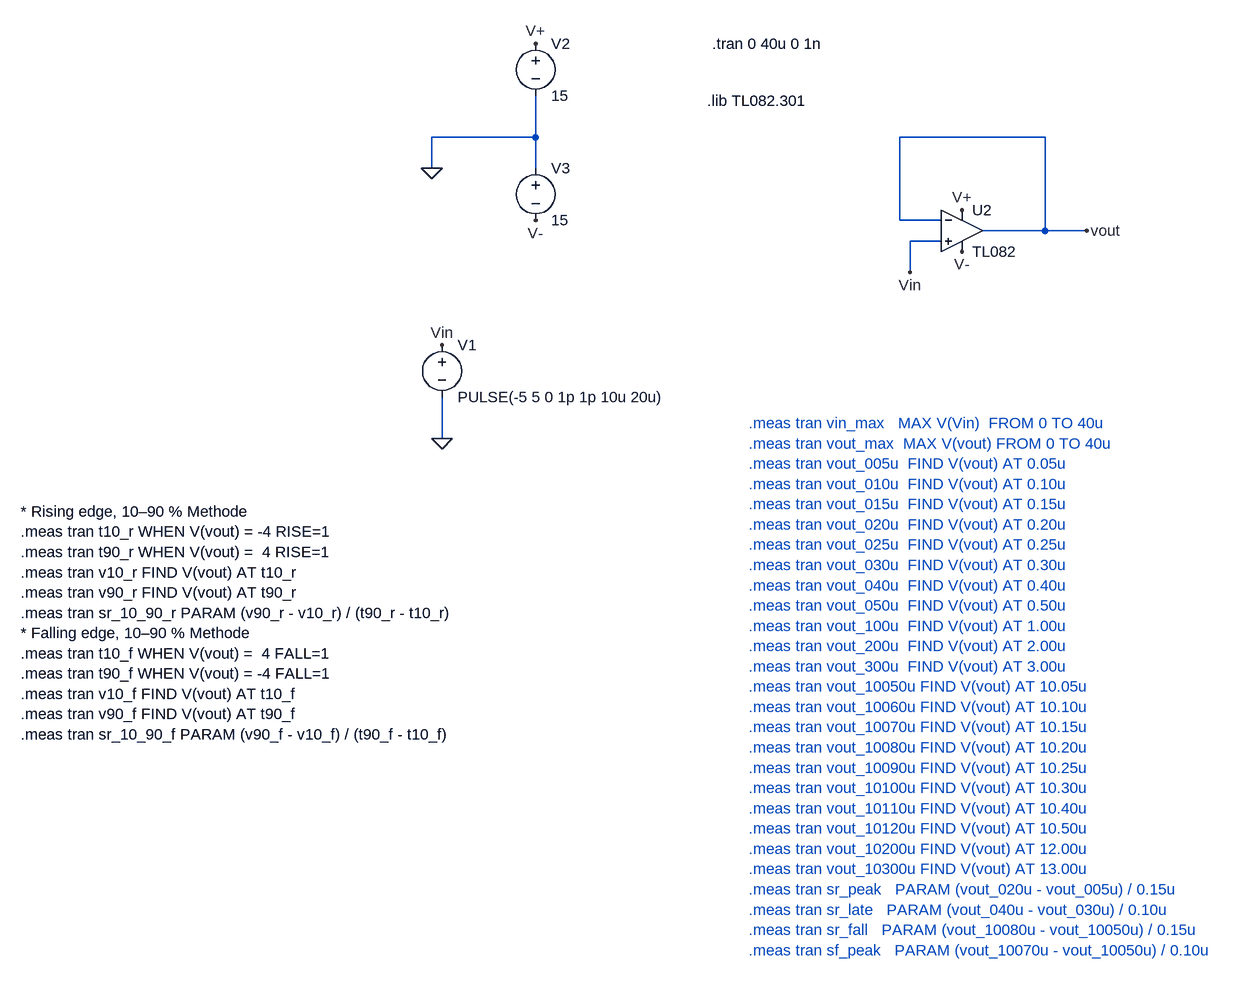
[diagram p0: schematic WORKS-non-inverting-buffer-test-slew-rate-tl802-op-amp.asc]
WORKS-non-inverting-buffer-test-slew-rate-tl802-op-amp.asc, the LTspice schematic file:
Version 4
SHEET 1 1576 900
WIRE -560 -128 -560 -192
WIRE -560 -128 -720 -128
WIRE 224 -128 0 -128
WIRE -720 -80 -720 -128
WIRE -560 -80 -560 -128
WIRE 0 0 0 -128
WIRE 64 0 0 0
WIRE 224 16 224 -128
WIRE 224 16 128 16
WIRE 288 16 224 16
WIRE 64 32 16 32
WIRE 16 80 16 32
WIRE -704 336 -704 272
FLAG 288 16 vout
FLAG 16 80 Vin
FLAG -704 336 0
FLAG -704 192 Vin
FLAG -720 -80 0
FLAG -560 0 V-
FLAG -560 -272 V+
FLAG 96 48 V-
FLAG 96 -16 V+
SYMBOL voltage -704 176 R0
SYMATTR InstName V1
SYMATTR Value PULSE(-5 5 0 1p 1p 10u 20u)
SYMBOL OpAmps/opamp2 96 -48 R0
SYMATTR InstName U2
SYMATTR Value TL082
SYMBOL Voltage -560 -288 R0
SYMATTR InstName V2
SYMATTR Value 15
SYMBOL Voltage -560 -96 R0
SYMATTR InstName V3
SYMATTR Value 15
TEXT -296 -184 Left 2 !.lib TL082.301
TEXT -288 -272 Left 2 !.tran 0 40u 0 1n
TEXT -232 312 Left 2 ;.meas tran vin_max   MAX V(Vin)  FROM 0 TO 40u\n.meas tran vout_max  MAX V(vout) FROM 0 TO 40u\n.meas tran vout_005u  FIND V(vout) AT 0.05u\n.meas tran vout_010u  FIND V(vout) AT 0.10u\n.meas tran vout_015u  FIND V(vout) AT 0.15u\n.meas tran vout_020u  FIND V(vout) AT 0.20u\n.meas tran vout_025u  FIND V(vout) AT 0.25u\n.meas tran vout_030u  FIND V(vout) AT 0.30u\n.meas tran vout_040u  FIND V(vout) AT 0.40u\n.meas tran vout_050u  FIND V(vout) AT 0.50u\n.meas tran vout_100u  FIND V(vout) AT 1.00u\n.meas tran vout_200u  FIND V(vout) AT 2.00u\n.meas tran vout_300u  FIND V(vout) AT 3.00u\n.meas tran vout_10050u FIND V(vout) AT 10.05u\n.meas tran vout_10060u FIND V(vout) AT 10.10u\n.meas tran vout_10070u FIND V(vout) AT 10.15u\n.meas tran vout_10080u FIND V(vout) AT 10.20u\n.meas tran vout_10090u FIND V(vout) AT 10.25u\n.meas tran vout_10100u FIND V(vout) AT 10.30u\n.meas tran vout_10110u FIND V(vout) AT 10.40u\n.meas tran vout_10120u FIND V(vout) AT 10.50u\n.meas tran vout_10200u FIND V(vout) AT 12.00u\n.meas tran vout_10300u FIND V(vout) AT 13.00u\n.meas tran sr_peak   PARAM (vout_020u - vout_005u) / 0.15u\n.meas tran sr_late   PARAM (vout_040u - vout_030u) / 0.10u\n.meas tran sr_fall   PARAM (vout_10080u - vout_10050u) / 0.15u\n.meas tran sf_peak   PARAM (vout_10070u - vout_10050u) / 0.10u
TEXT -1352 448 Left 2 !* Rising edge, 10–90 % Methode\n.meas tran t10_r WHEN V(vout) = -4 RISE=1\n.meas tran t90_r WHEN V(vout) =  4 RISE=1\n.meas tran v10_r FIND V(vout) AT t10_r\n.meas tran v90_r FIND V(vout) AT t90_r\n.meas tran sr_10_90_r PARAM (v90_r - v10_r) / (t90_r - t10_r)\n* Falling edge, 10–90 % Methode\n.meas tran t10_f WHEN V(vout) =  4 FALL=1\n.meas tran t90_f WHEN V(vout) = -4 FALL=1\n.meas tran v10_f FIND V(vout) AT t10_f\n.meas tran v90_f FIND V(vout) AT t90_f\n.meas tran sr_10_90_f PARAM (v90_f - v10_f) / (t90_f - t10_f)

The netlist it stands for:
* WORKS-non-inverting-buffer-test-slew-rate-tl802-op-amp.asc
V1 Vin 0 PULSE(-5 5 0 1p 1p 10u 20u)
XU2 Vin vout V+ V- vout TL082  ; pins In+ In- V+ V- OUT
V2 V+ 0 15
V3 0 V- 15
.lib TL082.301
.tran 0 40u 0 1n
* .meas tran vin_max   MAX V(Vin)  FROM 0 TO 40u
* .meas tran vout_max  MAX V(vout) FROM 0 TO 40u
* .meas tran vout_005u  FIND V(vout) AT 0.05u
* .meas tran vout_010u  FIND V(vout) AT 0.10u
* .meas tran vout_015u  FIND V(vout) AT 0.15u
* .meas tran vout_020u  FIND V(vout) AT 0.20u
* .meas tran vout_025u  FIND V(vout) AT 0.25u
* .meas tran vout_030u  FIND V(vout) AT 0.30u
* .meas tran vout_040u  FIND V(vout) AT 0.40u
* .meas tran vout_050u  FIND V(vout) AT 0.50u
* .meas tran vout_100u  FIND V(vout) AT 1.00u
* .meas tran vout_200u  FIND V(vout) AT 2.00u
* .meas tran vout_300u  FIND V(vout) AT 3.00u
* .meas tran vout_10050u FIND V(vout) AT 10.05u
* .meas tran vout_10060u FIND V(vout) AT 10.10u
* .meas tran vout_10070u FIND V(vout) AT 10.15u
* .meas tran vout_10080u FIND V(vout) AT 10.20u
* .meas tran vout_10090u FIND V(vout) AT 10.25u
* .meas tran vout_10100u FIND V(vout) AT 10.30u
* .meas tran vout_10110u FIND V(vout) AT 10.40u
* .meas tran vout_10120u FIND V(vout) AT 10.50u
* .meas tran vout_10200u FIND V(vout) AT 12.00u
* .meas tran vout_10300u FIND V(vout) AT 13.00u
* .meas tran sr_peak   PARAM (vout_020u - vout_005u) / 0.15u
* .meas tran sr_late   PARAM (vout_040u - vout_030u) / 0.10u
* .meas tran sr_fall   PARAM (vout_10080u - vout_10050u) / 0.15u
* .meas tran sf_peak   PARAM (vout_10070u - vout_10050u) / 0.10u
* Rising edge, 10–90 % Methode
.meas tran t10_r WHEN V(vout) = -4 RISE=1
.meas tran t90_r WHEN V(vout) =  4 RISE=1
.meas tran v10_r FIND V(vout) AT t10_r
.meas tran v90_r FIND V(vout) AT t90_r
.meas tran sr_10_90_r PARAM (v90_r - v10_r) / (t90_r - t10_r)
* Falling edge, 10–90 % Methode
.meas tran t10_f WHEN V(vout) =  4 FALL=1
.meas tran t90_f WHEN V(vout) = -4 FALL=1
.meas tran v10_f FIND V(vout) AT t10_f
.meas tran v90_f FIND V(vout) AT t90_f
.meas tran sr_10_90_f PARAM (v90_f - v10_f) / (t90_f - t10_f)
.backanno
.end